# Altium project Board.PrjPcb
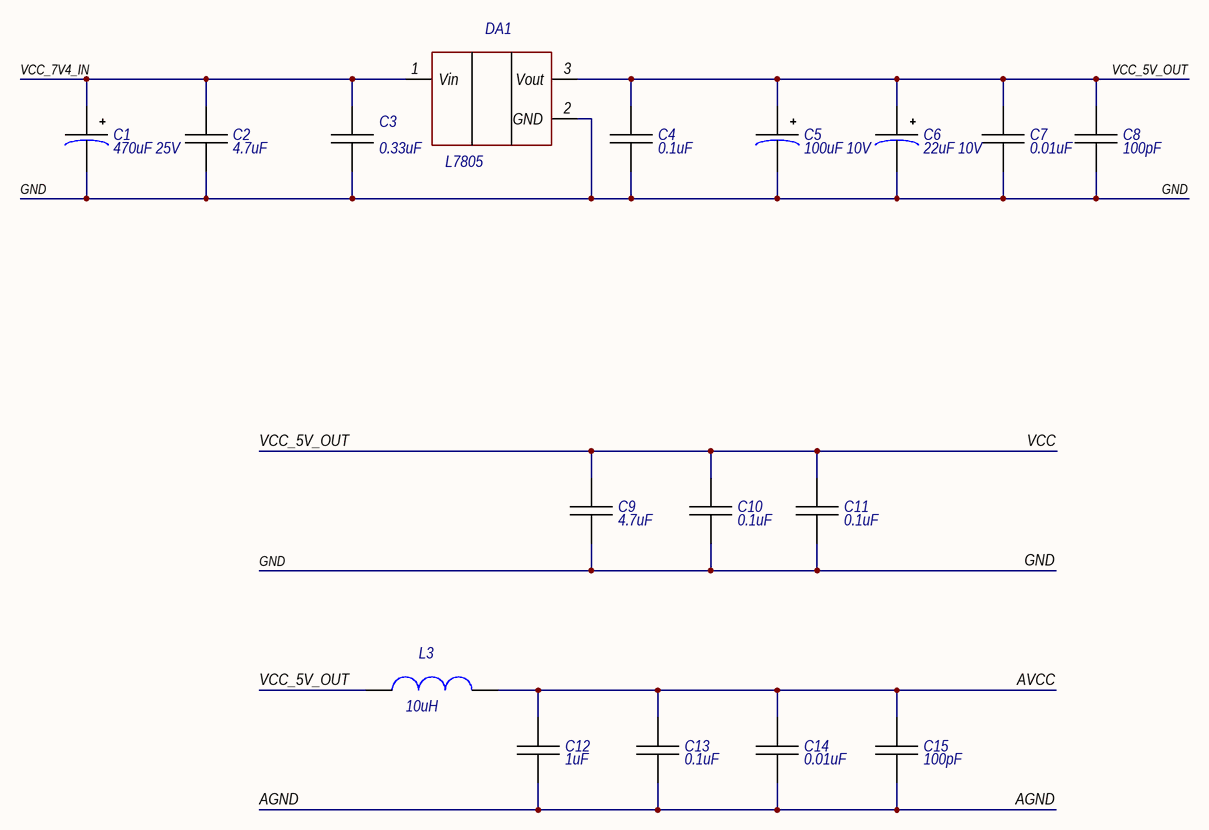
[diagram p0: Schematic_page1.SchDoc]
3 sheets, 48 parts. Net scope: global (net labels, ports and power ports of the same name join across sheets).
Board file: PCB v2.8.PcbDoc
Sheets:
  Schematic_page1.SchDoc
  Schematic_page2.SchDoc
  Schematic_page3.SchDoc

## Sheet Schematic_page1.SchDoc
size 420 x 297 mm; Author: Дубатовка В.В.; Address1: Address1; Address2: Address2; Address3: Address3; Address4: Address4; DocumentNumber: АБВГ.123456.001 Э3; SheetNumber: 1; SheetTotal: 3; Scale: 1:1; DocumentType: Схема электрическая принципиальная; FirstReferrence: АБВГ.123456.001

### Parts
C1  470uF 25V  [CapElec_8x16_3.5mm]
C2  4.7uF  [C0603]
C3  0.33uF  [C0603]
C4  0.1uF  [C0603]
C5  100uF 10V  [CapElec_5x11_2mm]
C6  22uF 10V  [TANT-B]
C7  0.01uF  [C0603]
C8  100pF  [C0603]
C9  4.7uF  [C0603]
C10  0.1uF  [C0603]
C11  0.1uF  [C0603]
C12  1uF  [C0603]
C13  0.1uF  [C0603]
C14  0.01uF  [C0603]
C15  100pF  [C0603]
DA1  L7805  [TO-220A]
L3  10uH  [IND1206]

### Nets
AGND: C12.2 C13.2 C14.2 C15.2
AVCC: C12.1 C13.1 C14.1 C15.1 L3.2
GND: C1.2 C2.2 C3.2 C4.2 C5.2 C6.2 C7.2 C8.2 C9.2 C10.2 C11.2 DA1.2(GND)
VCC: C4.1 C5.1 C6.1 C7.1 C8.1 C9.1 C10.1 C11.1 DA1.3(Vout) L3.1  [also labelled VCC_5V_OUT]
VCC_7V4_IN: C1.1 C2.1 C3.1 DA1.1(Vin)

### Notes on the sheet
- Перв. примен.
- Справ. №
- Подп. и дата
- Инв. № дубл.
- Взам. инв. №
- Разраб.
- Изм.
- Лист
- № докум.
- Подп.
- Дата
- Лит.
- Масса
- Масштаб
- Пров.
- Т.контр.
- Листов
- Инв. № подл.
- Утв.
- Н.контр.
- 2.106-A3
- Копировал
- Формат А3

### Library data of the parts
C1 = Capacitor_Elec: Manufacturer: JB; Model: 25V 20%; Value: 470uF 25V; HelpURL: https://www.chipdip.by/product0/9000565915; Case: 8x16_3.5mm
C2-C4 C7-C15 = Capasitor: Case: C0603; Manufacturer: *; HelpURL: *; Model: *
  C2 C9: Value: 4.7uF
  C3: Value: 0.33uF
  C4 C10 C11 C13: Value: 0.1uF
  C7 C14: Value: 0.01uF
  C8 C15: Value: 100pF
  C12: Value: 1uF
C5 = Capacitor_Elec: Manufacturer: JB; Model: 10V 20%; Value: 100uF 10V; HelpURL: https://www.chipdip.by/product0/9000565886; Case: 5x11_2mm
C6 = Capasitor_Tantalum: Model: 10V 10%; Value: 22uF 10V; Case: TANT-B; Manufacturer: -; HelpURL: https://www.chipdip.by/product0/9000502415
DA1 = L75xx: Linear Voltage Regulator IC  1 Output  1.5A TO-220AB; Manufacturer: STMicroelectronics; Case: TO-220; HelpURL: https://www.digikey.com/product-detail/en/stmicroelectronics/L7805CV/497-1443-5-ND/585964; Model: L7805
L3 = Inductivity: Model: *; Manufacturer: *; HelpURL: *; Case: *; Value: 10uH

## Sheet Schematic_page2.SchDoc
size 420 x 297 mm; Address1: Address1; Address2: Address2; Address3: Address3; Address4: Address4; DocumentNumber: АБВГ.123456.001 Э3; SheetNumber: 1; Scale: 1:1; DocumentType: Схема электрическая принципиальная; FirstReferrence: АБВГ.123456.001
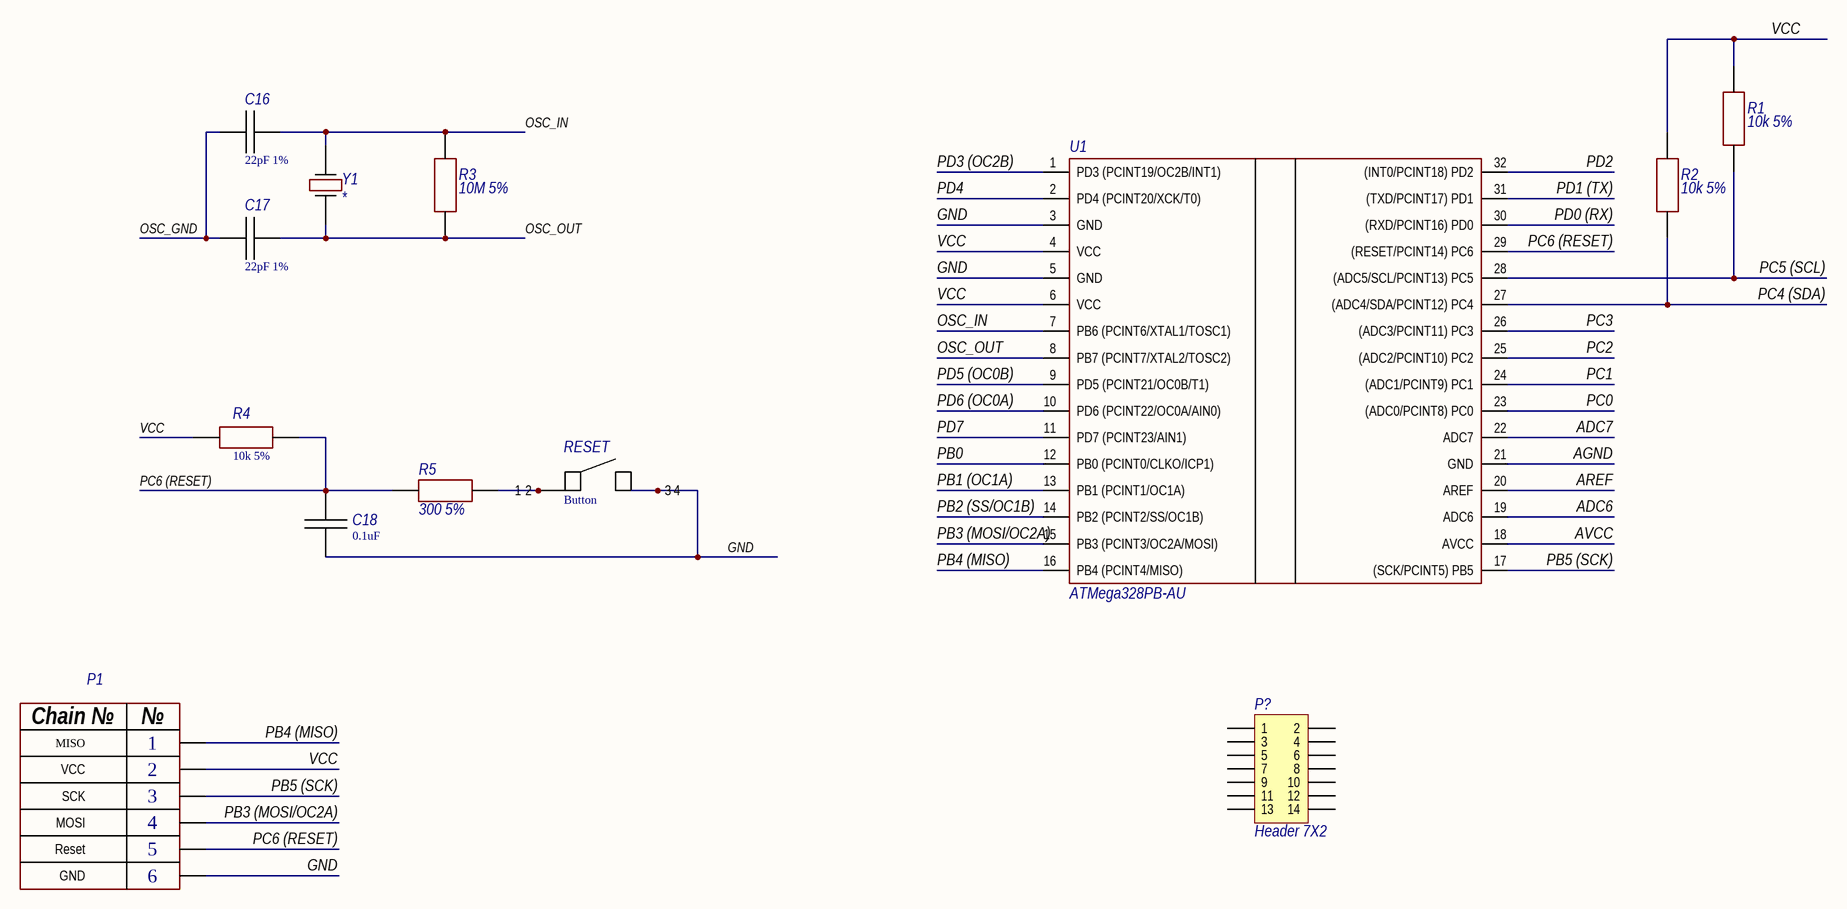
[diagram p1: Schematic_page2.SchDoc]

### Parts
C16  22pF 1%  [C0603]
C17  22pF 1%  [C0603]
C18  0.1uF  [C0603]
P1  ICSP  [2x3 Male Header Through Hole Pitch 2.54 mm]  (value not drawn)
P?  Header 7X2  [HDR2X7]
R1  10k 5%  [R0603]
R2  10k 5%  [R0603]
R3  10M 5%  [R0603]
R4  10k 5%  [R0603]
R5  300 5%  [R0603]
RESET  Button  [KMR221GLFS]
U1  ATMega328PB-AU  [TQFP-32 (7x7)]
Y1  *  [HC-49S]

### Nets
ADC6: U1.19(ADC6)
ADC7: U1.22(ADC7)
AGND: U1.21(GND)
AREF: U1.20(AREF)
AVCC: U1.18(AVCC)
GND: C18.2 P1.6(GND) RESET.3 RESET.4 U1.3(GND) U1.5(GND)
OSC_GND: C16.1 C17.2
OSC_IN: C16.2 R3.2 U1.7(PB6_(PCINT6/XTAL1/TOSC1)) Y1.2
OSC_OUT: C17.1 R3.1 U1.8(PB7_(PCINT7/XTAL2/TOSC2)) Y1.1
PB0: U1.12(PB0_(PCINT0/CLKO/ICP1))
PB1 (OC1A): U1.13(PB1_(PCINT1/OC1A))
PB2 (SS/OC1B): U1.14(PB2_(PCINT2/SS/OC1B))
PB3 (MOSI/OC2A): P1.4(MOSI) U1.15(PB3_(PCINT3/OC2A/MOSI))
PB4 (MISO): P1.1(MISO) U1.16(PB4_(PCINT4/MISO))
PB5 (SCK): P1.3(SCK) U1.17((SCK/PCINT5)_PB5)
PC0: U1.23((ADC0/PCINT8)_PC0)
PC1: U1.24((ADC1/PCINT9)_PC1)
PC2: U1.25((ADC2/PCINT10)_PC2)
PC3: U1.26((ADC3/PCINT11)_PC3)
PC4 (SDA): R2.1 U1.27((ADC4/SDA/PCINT12)_PC4)
PC5 (SCL): R1.1 U1.28((ADC5/SCL/PCINT13)_PC5)
PC6 (RESET): C18.1 P1.5(Reset) R4.2 R5.1 U1.29((RESET/PCINT14)_PC6)
PD0 (RX): U1.30((RXD/PCINT16)_PD0)
PD1 (TX): U1.31((TXD/PCINT17)_PD1)
PD2: U1.32((INT0/PCINT18)_PD2)
PD3 (OC2B): U1.1(PD3_(PCINT19/OC2B/INT1))
PD4: U1.2(PD4_(PCINT20/XCK/T0))
PD5 (OC0B): U1.9(PD5_(PCINT21/OC0B/T1))
PD6 (OC0A): U1.10(PD6_(PCINT22/OC0A/AIN0))
PD7: U1.11(PD7_(PCINT23/AIN1))
VCC: P1.2(VCC) R1.2 R2.2 R4.1 U1.4(VCC) U1.6(VCC)
NetR5_2: R5.2 RESET.1 RESET.2

Not connected (* = marked no-connect by the designer): P? 1 2 3 4 5 6 7 8 9 10 11 12 13 14

### Notes on the sheet
- Перв. примен.
- Справ. №
- Подп. и дата
- Инв. № дубл.
- Взам. инв. №
- Разраб.
- Изм.
- Лист
- № докум.
- Подп.
- Дата
- Лит.
- Масса
- Масштаб
- Пров.
- Т.контр.
- Листов
- Инв. № подл.
- Утв.
- Н.контр.
- 2.106-A3
- Копировал
- Формат А3
- (in symbol ICSP) Chain №; №

### Library data of the parts
C16-C18 = Capasitor: Case: *; Manufacturer: *; HelpURL: *; Model: *
  C16 C17: Value: 22pF 1%
  C18: Value: 0.1uF
P? = Header 7X2: Header, 7-Pin, Dual row; LatestRevisionDate: 17-Jul-2002; LatestRevisionNote: Re-released for DXP Platform.; Publisher: Altium Limited
R1-R5 = Resistor: Model: *; HelpURL: *; Case: *; Manufacturer: *
  R1 R2 R4: Value: 10k 5%
  R3: Value: 10M 5%
  R5: Value: 300 5%
RESET = Button: SWITCH TACTILE SPST-NO 0.05A 32V; Manufacturer: C&K; HelpURL: https://www.digikey.com/product-detail/en/c-k/KMR221GLFS/401-1427-1-ND/550466; Model: KMR221GLFS; Case: KMR221GLFS
U1 = ATMega328P: AVR AVR® ATmega Microcontroller IC 8-Bit 20MHz 32KB (16K x 16) FLASH 32-TQFP (7x7); Manufacturer: Microchip Technology; Model: ATMega328PB-AU; HelpURL: https://www.digikey.com/product-detail/en/microchip-technology/ATMEGA328PB-AU/ATMEGA328PB-AU-ND/5638812; Case: TQFP-32
Y1 = Crystal: Value: *; Model: *; HelpURL: *; Case: *
P1 = ICSP: Case: *; Model: *; HelpURL: *

## Sheet Schematic_page3.SchDoc
size 420 x 297 mm; Address1: Address1; Address2: Address2; Address3: Address3; Address4: Address4; DocumentNumber: АБВГ.123456.001 Э3; SheetNumber: 1; SheetTotal: 3; Scale: 1:1; DocumentType: Схема электрическая принципиальная; FirstReferrence: АБВГ.123456.001
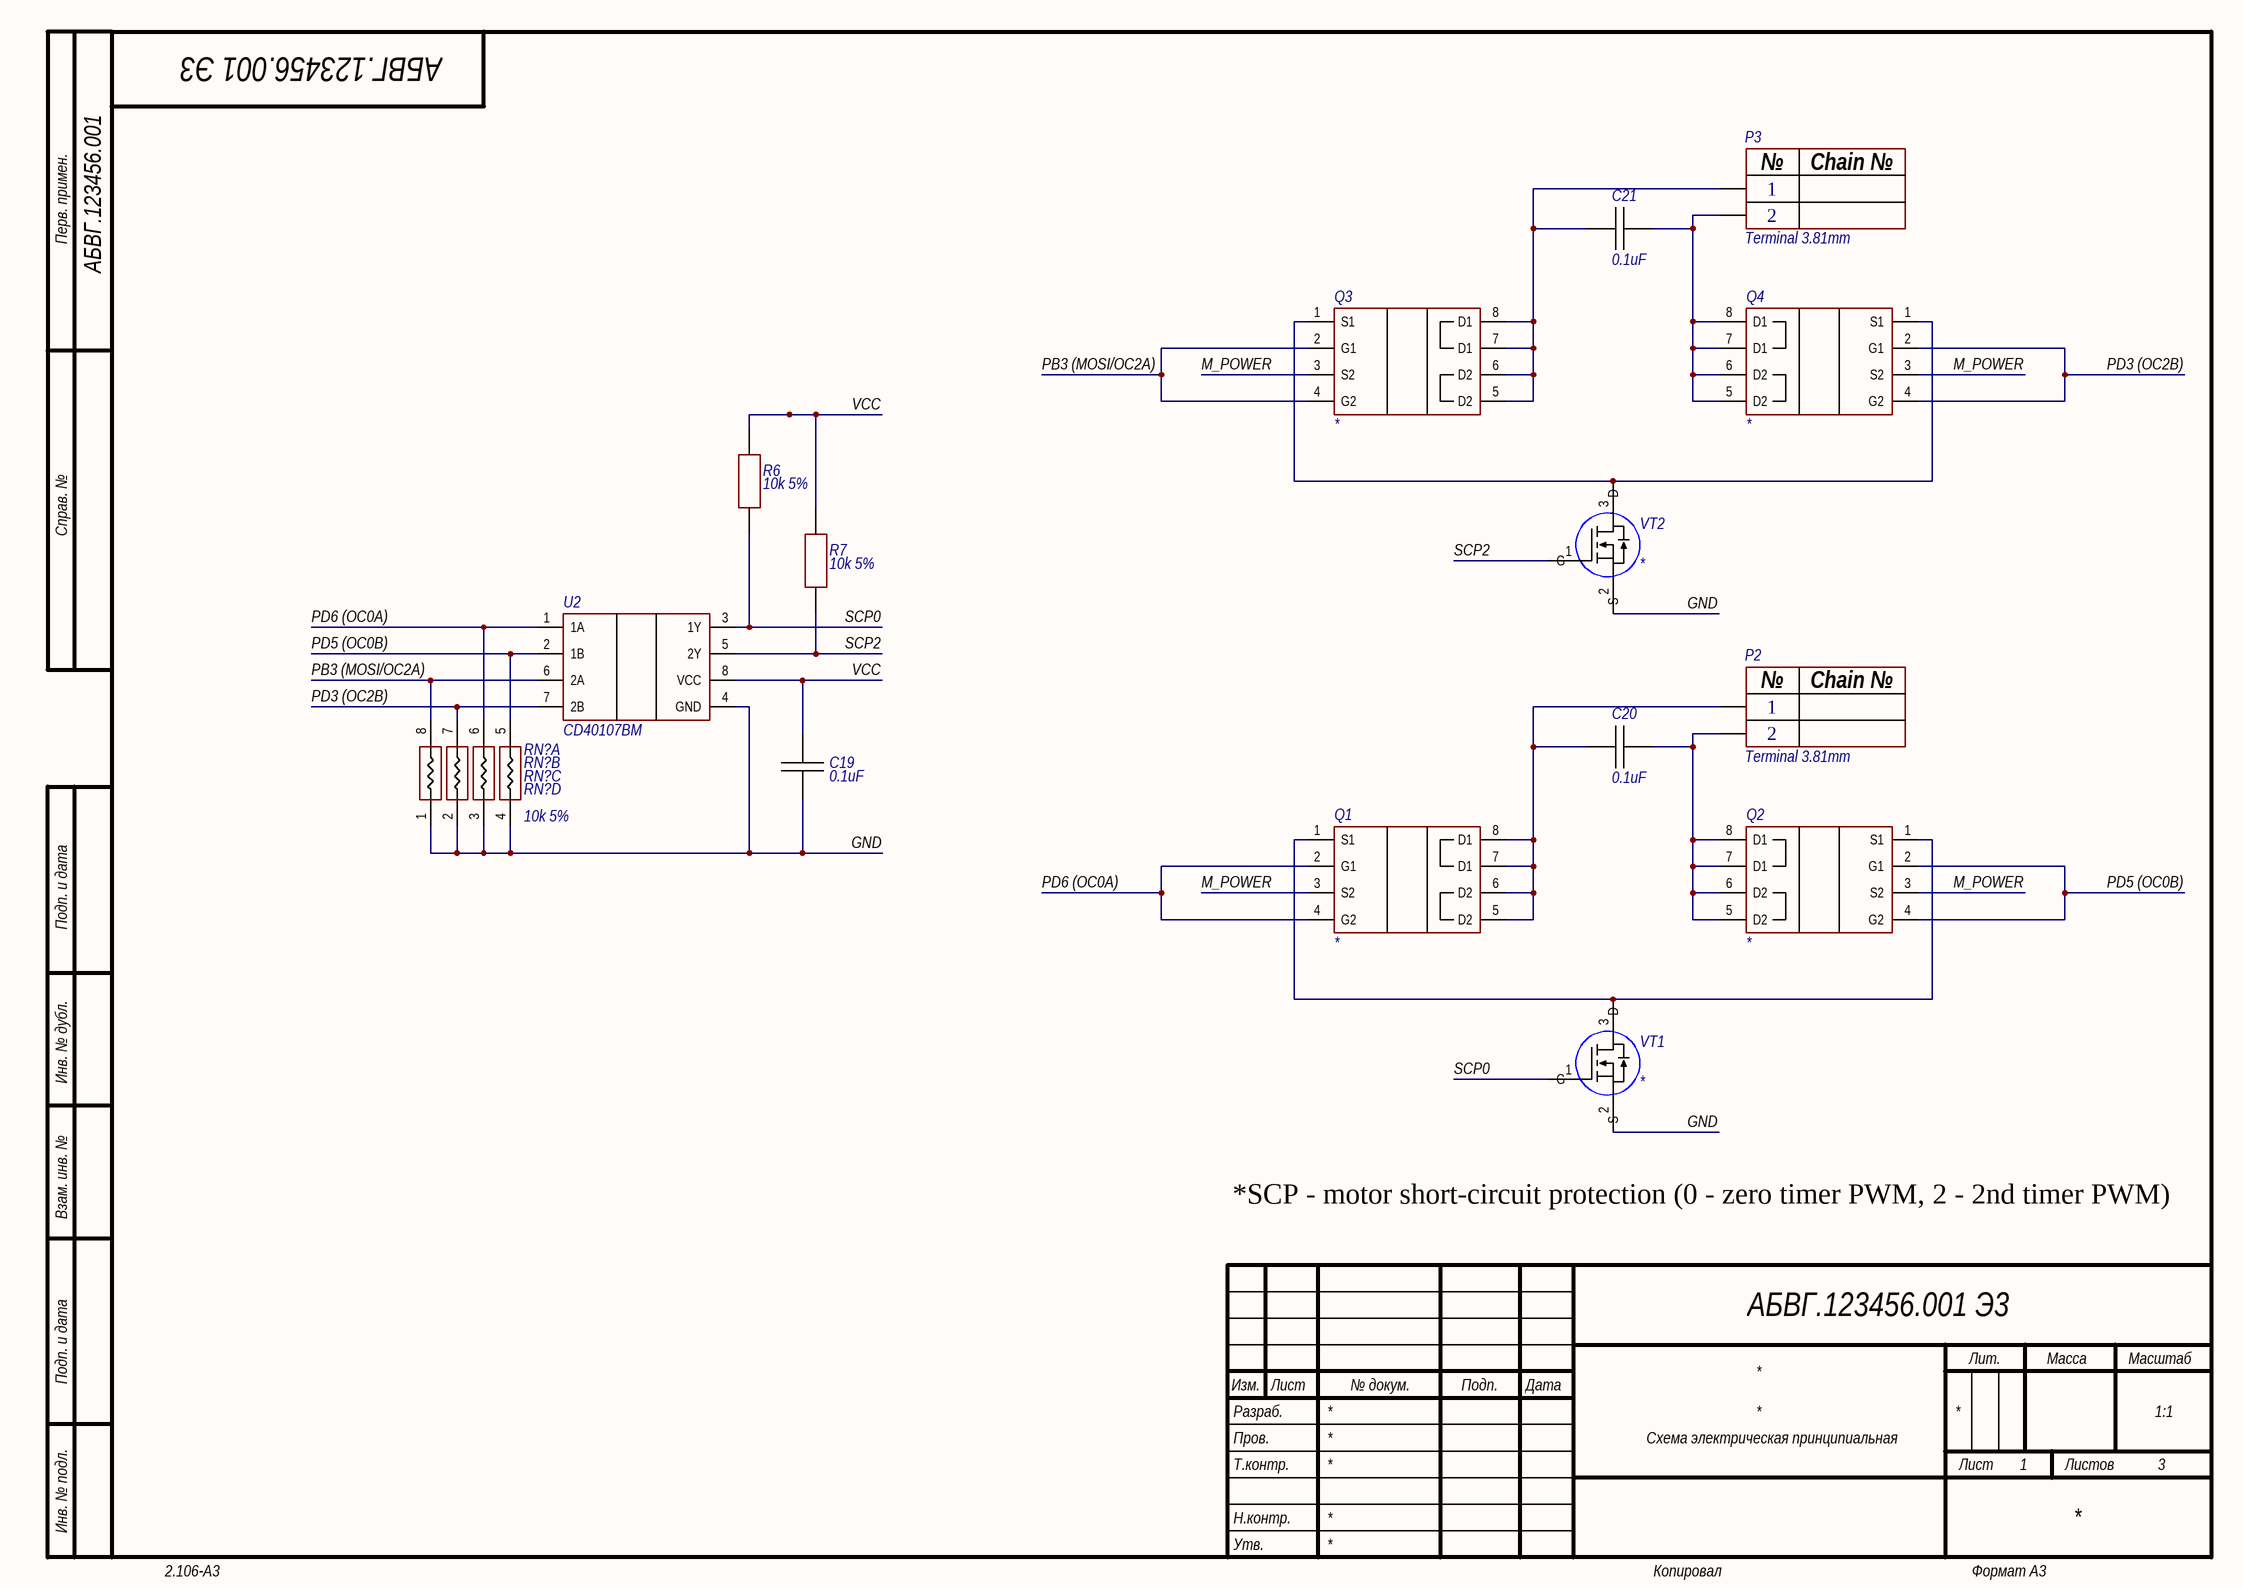
[diagram p2: Schematic_page3.SchDoc]

### Parts
(Parts that share a designator on the sheet are numbered #1, #2 ... from top to bottom, then left to right.)
C19  0.1uF  [C0603]
C20  0.1uF  [C0603]
C21  0.1uF  [C0603]
P2  Terminal 3.81mm  [Terminal 2x 3.81mm]
P3  Terminal 3.81mm  [Terminal 2x 3.81mm]
Q1  *  [SOIC-8]
Q2  *  [SOIC-8]
Q3  *  [SOIC-8]
Q4  *  [SOIC-8]
R6  10k 5%  [R0603]
R7  10k 5%  [R0603]
RN?#1  10k 5%  [RN_YC164-JR-072K2L]  (part A of 4)  (graphical)
RN?#2  10k 5%  [RN_YC164-JR-072K2L]  (value not drawn)  (part B of 4)  (graphical)
RN?#3  10k 5%  [RN_YC164-JR-072K2L]  (value not drawn)  (part C of 4)  (graphical)
RN?#4  10k 5%  [RN_YC164-JR-072K2L]  (value not drawn)  (part D of 4)  (graphical)
U2  CD40107BM  [SOIC-8]
VT1  *  [SOT-23-3]
VT2  *  [SOT-23-3]

### Nets
GND: C19.2 RN?#1.1 RN?#2.2 RN?#3.3 RN?#4.4 U2.4(GND) VT1.2(S) VT2.2(S)
M_POWER: Q1.3(S2) Q2.3(S2) Q3.3(S2) Q4.3(S2)
PB3 (MOSI/OC2A): Q3.2(G1) Q3.4(G2) RN?#1.8 U2.6(2A)
PD3 (OC2B): Q4.2(G1) Q4.4(G2) RN?#2.7 U2.7(2B)
PD5 (OC0B): Q2.2(G1) Q2.4(G2) RN?#4.5 U2.2(1B)
PD6 (OC0A): Q1.2(G1) Q1.4(G2) RN?#3.6 U2.1(1A)
SCP0: R6.2 U2.3(1Y) VT1.1(G)
SCP2: R7.2 U2.5(2Y) VT2.1(G)
VCC: C19.1 R6.1 R7.1 U2.8(VCC)
NetC20_1: C20.1 P2.2 Q2.5(D2) Q2.6(D2) Q2.7(D1) Q2.8(D1)
NetC20_2: C20.2 P2.1 Q1.5(D2) Q1.6(D2) Q1.7(D1) Q1.8(D1)
NetC21_1: C21.1 P3.2 Q4.5(D2) Q4.6(D2) Q4.7(D1) Q4.8(D1)
NetC21_2: C21.2 P3.1 Q3.5(D2) Q3.6(D2) Q3.7(D1) Q3.8(D1)
NetQ1_1: Q1.1(S1) Q2.1(S1) VT1.3(D)
NetQ3_1: Q3.1(S1) Q4.1(S1) VT2.3(D)

### Notes on the sheet
- (near P3) 1
- (near P3) 2
- (near P2) 1
- (near P2) 2
- *SCP - motor short-circuit protection (0 - zero timer PWM, 2 - 2nd timer PWM)
- Перв. примен.
- Справ. №
- Подп. и дата
- Инв. № дубл.
- Взам. инв. №
- Разраб.
- Изм.
- Лист
- № докум.
- Подп.
- Дата
- Лит.
- Масса
- Масштаб
- Пров.
- Т.контр.
- Листов
- Инв. № подл.
- Утв.
- Н.контр.
- 2.106-A3
- Копировал
- Формат А3
- (in symbol Terminal 3.81mm) №; Chain №

### Library data of the parts
C19-C21 = Capasitor: Value: 0.1uF; Case: *; Manufacturer: *; HelpURL: *; Model: *
Q1-Q4 = IRF7307: Mosfet Array N and P-Channel 20V 5.2A, 4.3A 2W Surface Mount 8-SO; Manufacturer: Infineon Technologies; Model: *; HelpURL: https://www.digikey.com/product-detail/en/infineon-technologies/IRF7307TRPBF/IRF7307PBFCT-ND/812597; Case: SOIC-8
R6 R7 = Resistor: Model: *; Value: 10k 5%; HelpURL: *; Case: *; Manufacturer: *
RN?#1-RN?#4 = Resistor Network: Manufacturer: Bourns; Model: CAT16-103J4; Value: 10k 5%; HelpURL: https://www.chipdip.by/product/cat16-103j4; Case: R0603x4
U2 = CD40107BM: NAND Gate IC 2 Channel Open Drain 8-SOIC; Manufacturer: Texas Instruments; Model: CD40107BM; HelpURL: https://www.chipdip.by/product/cd40107bm; Case: SOIC-8
VT1 VT2 = IRLML6344TRPBF: N-Channel 30V 5A (Ta) 1.3W (Ta) Surface Mount Micro3™/SOT-23; Manufacturer: Infineon Technologies; Case: SOT-23-3; HelpURL: https://www.digikey.com/product-detail/en/infineon-technologies/IRLML6344TRPBF/IRLML6344TRPBFCT-ND/2538168; Model: *
P2 P3 = Terminal 3.81mm: Manufacturer: *; HelpURL: *; Model: *; Case: *

## Nets that join several sheets
AGND: Schematic_page1 (C12.2 C13.2 C14.2 C15.2), Schematic_page2 (U1.21)
AVCC: Schematic_page1 (5 pins), Schematic_page2 (U1.18)
GND: Schematic_page1 (12 pins), Schematic_page2 (6 pins), Schematic_page3 (8 pins)
PB3 (MOSI/OC2A): Schematic_page2 (P1.4 U1.15), Schematic_page3 (Q3.2 Q3.4 RN?#1.8 U2.6)
PD3 (OC2B): Schematic_page2 (U1.1), Schematic_page3 (Q4.2 Q4.4 RN?#2.7 U2.7)
PD5 (OC0B): Schematic_page2 (U1.9), Schematic_page3 (Q2.2 Q2.4 RN?#4.5 U2.2)
PD6 (OC0A): Schematic_page2 (U1.10), Schematic_page3 (Q1.2 Q1.4 RN?#3.6 U2.1)
VCC: Schematic_page1 (10 pins), Schematic_page2 (6 pins), Schematic_page3 (C19.1 R6.1 R7.1 U2.8)